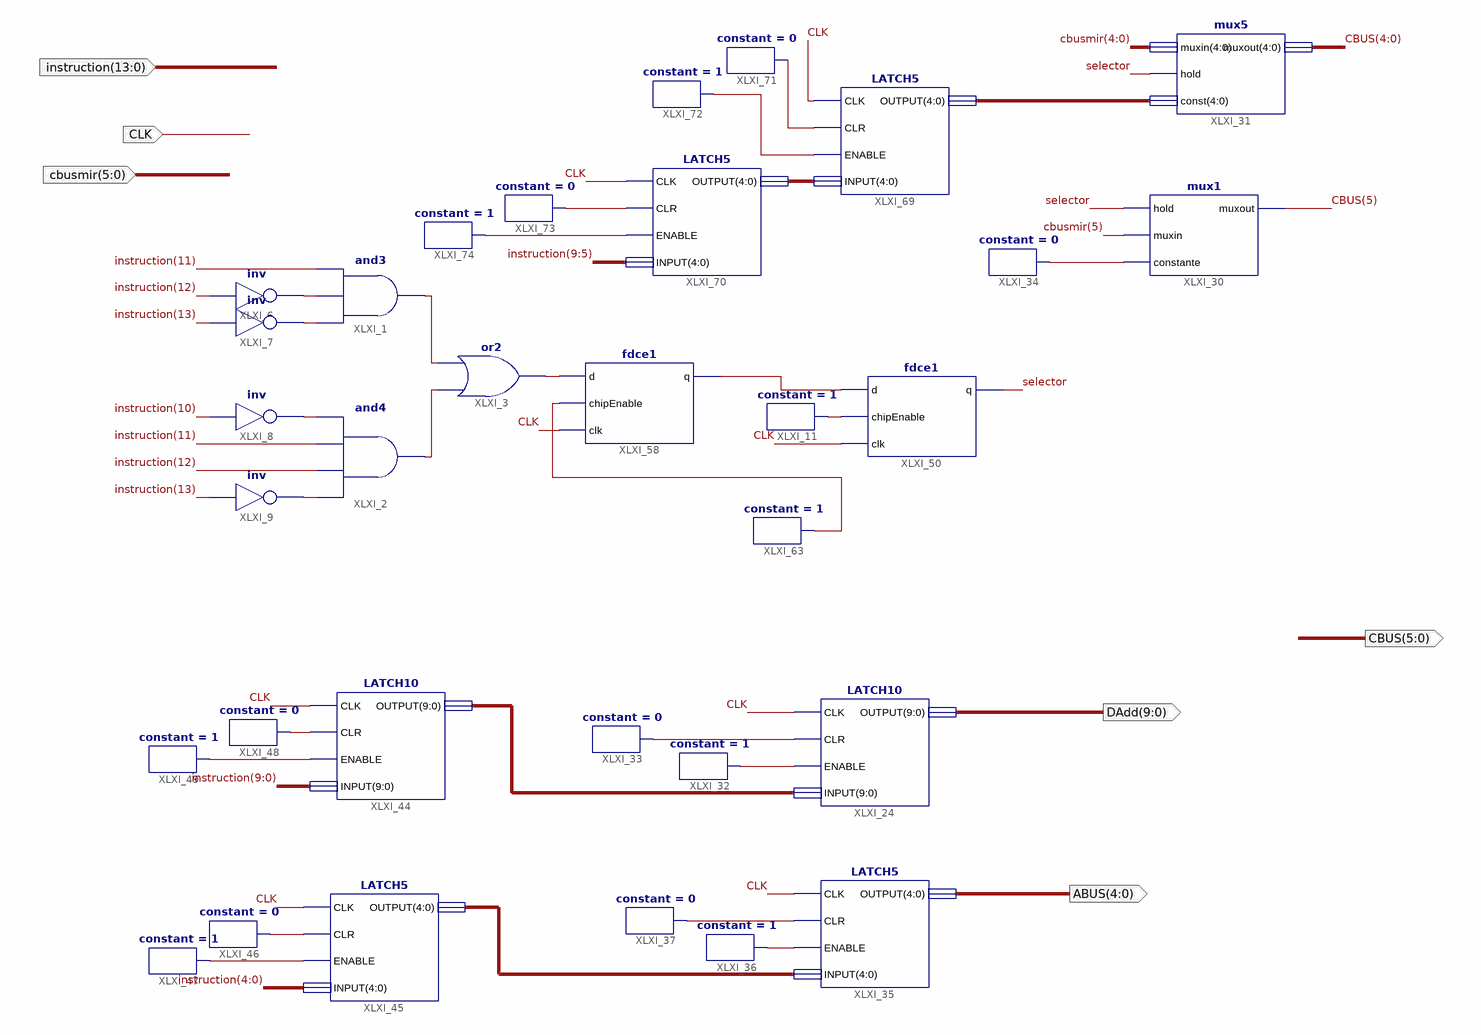
[diagram p0: schematic sheet 1]
// Xilinx ISE schematic Decode.sch (artix7) as structural Verilog: 32 symbols, 6 ports
module Decode (
  input  CLK,
  input  [5:0] cbusmir,
  input  [13:0] instruction,
  output [5:0] CBUS,
  output [9:0] DAdd,
  output [4:0] ABUS
);

  wire selector, XLXN_4, XLXN_5, XLXN_6, XLXN_7, XLXN_8, XLXN_9, XLXN_11, XLXN_120, XLXN_121, XLXN_135,
       XLXN_136, XLXN_147, XLXN_157, XLXN_158, XLXN_162, XLXN_163, XLXN_183, XLXN_190, XLXN_192, XLXN_204,
       XLXN_205, XLXN_209, XLXN_210;
  wire [4:0] XLXN_165, XLXN_201, XLXN_202;
  wire [9:0] XLXN_167;

  LATCH10 XLXI_24 (.CLK(CLK), .CLR(XLXN_120), .ENABLE(XLXN_121), .INPUT(XLXN_167), .OUTPUT(DAdd));
  constant #(.CValue("1")) XLXI_32 (.O(XLXN_121));
  constant #(.CValue("0")) XLXI_33 (.O(XLXN_120));
  LATCH5 XLXI_35 (.CLK(CLK), .CLR(XLXN_135), .ENABLE(XLXN_136), .INPUT(XLXN_165), .OUTPUT(ABUS));
  constant #(.CValue("1")) XLXI_36 (.O(XLXN_136));
  constant #(.CValue("0")) XLXI_37 (.O(XLXN_135));
  LATCH10 XLXI_44 (.CLK(CLK), .CLR(XLXN_157), .ENABLE(XLXN_158), .INPUT(instruction[9:0]), .OUTPUT(XLXN_167));
  LATCH5 XLXI_45 (.CLK(CLK), .CLR(XLXN_162), .ENABLE(XLXN_163), .INPUT(instruction[4:0]), .OUTPUT(XLXN_165));
  constant #(.CValue("0")) XLXI_46 (.O(XLXN_162));
  constant #(.CValue("1")) XLXI_47 (.O(XLXN_163));
  constant #(.CValue("0")) XLXI_48 (.O(XLXN_157));
  constant #(.CValue("1")) XLXI_49 (.O(XLXN_158));
  and XLXI_1 (XLXN_4, XLXN_7, XLXN_6, instruction[11]);
  and XLXI_2 (XLXN_5, XLXN_9, instruction[12], instruction[11], XLXN_8);
  not XLXI_6 (XLXN_6, instruction[12]);
  not XLXI_7 (XLXN_7, instruction[13]);
  not XLXI_8 (XLXN_8, instruction[10]);
  not XLXI_9 (XLXN_9, instruction[13]);
  or XLXI_3 (XLXN_183, XLXN_5, XLXN_4);
  fdce1 XLXI_58 (.clk(CLK), .chipEnable(XLXN_192), .d(XLXN_183), .q(XLXN_190));
  constant #(.CValue("1")) XLXI_11 (.O(XLXN_11));
  fdce1 XLXI_50 (.clk(CLK), .chipEnable(XLXN_11), .d(XLXN_190), .q(selector));
  constant #(.CValue("1")) XLXI_63 (.O(XLXN_192));
  mux5 XLXI_31 (.muxin(cbusmir[4:0]), .hold(selector), .\const (XLXN_201), .muxout(CBUS[4:0]));
  mux1 XLXI_30 (.hold(selector), .muxin(cbusmir[5]), .constante(XLXN_147), .muxout(CBUS[5]));
  constant #(.CValue("0")) XLXI_34 (.O(XLXN_147));
  LATCH5 XLXI_69 (.CLK(CLK), .CLR(XLXN_204), .ENABLE(XLXN_205), .INPUT(XLXN_202), .OUTPUT(XLXN_201));
  LATCH5 XLXI_70 (.CLK(CLK), .CLR(XLXN_210), .ENABLE(XLXN_209), .INPUT(instruction[9:5]), .OUTPUT(XLXN_202));
  constant #(.CValue("0")) XLXI_71 (.O(XLXN_204));
  constant #(.CValue("1")) XLXI_72 (.O(XLXN_205));
  constant #(.CValue("0")) XLXI_73 (.O(XLXN_210));
  constant #(.CValue("1")) XLXI_74 (.O(XLXN_209));
endmodule
